# Altium schematic sheet FOC_Driver.SchDoc: FOC_Driver
size 431 x 342 mm; Author: Aiano_czm; SheetNumber: 1; SheetTotal: 1
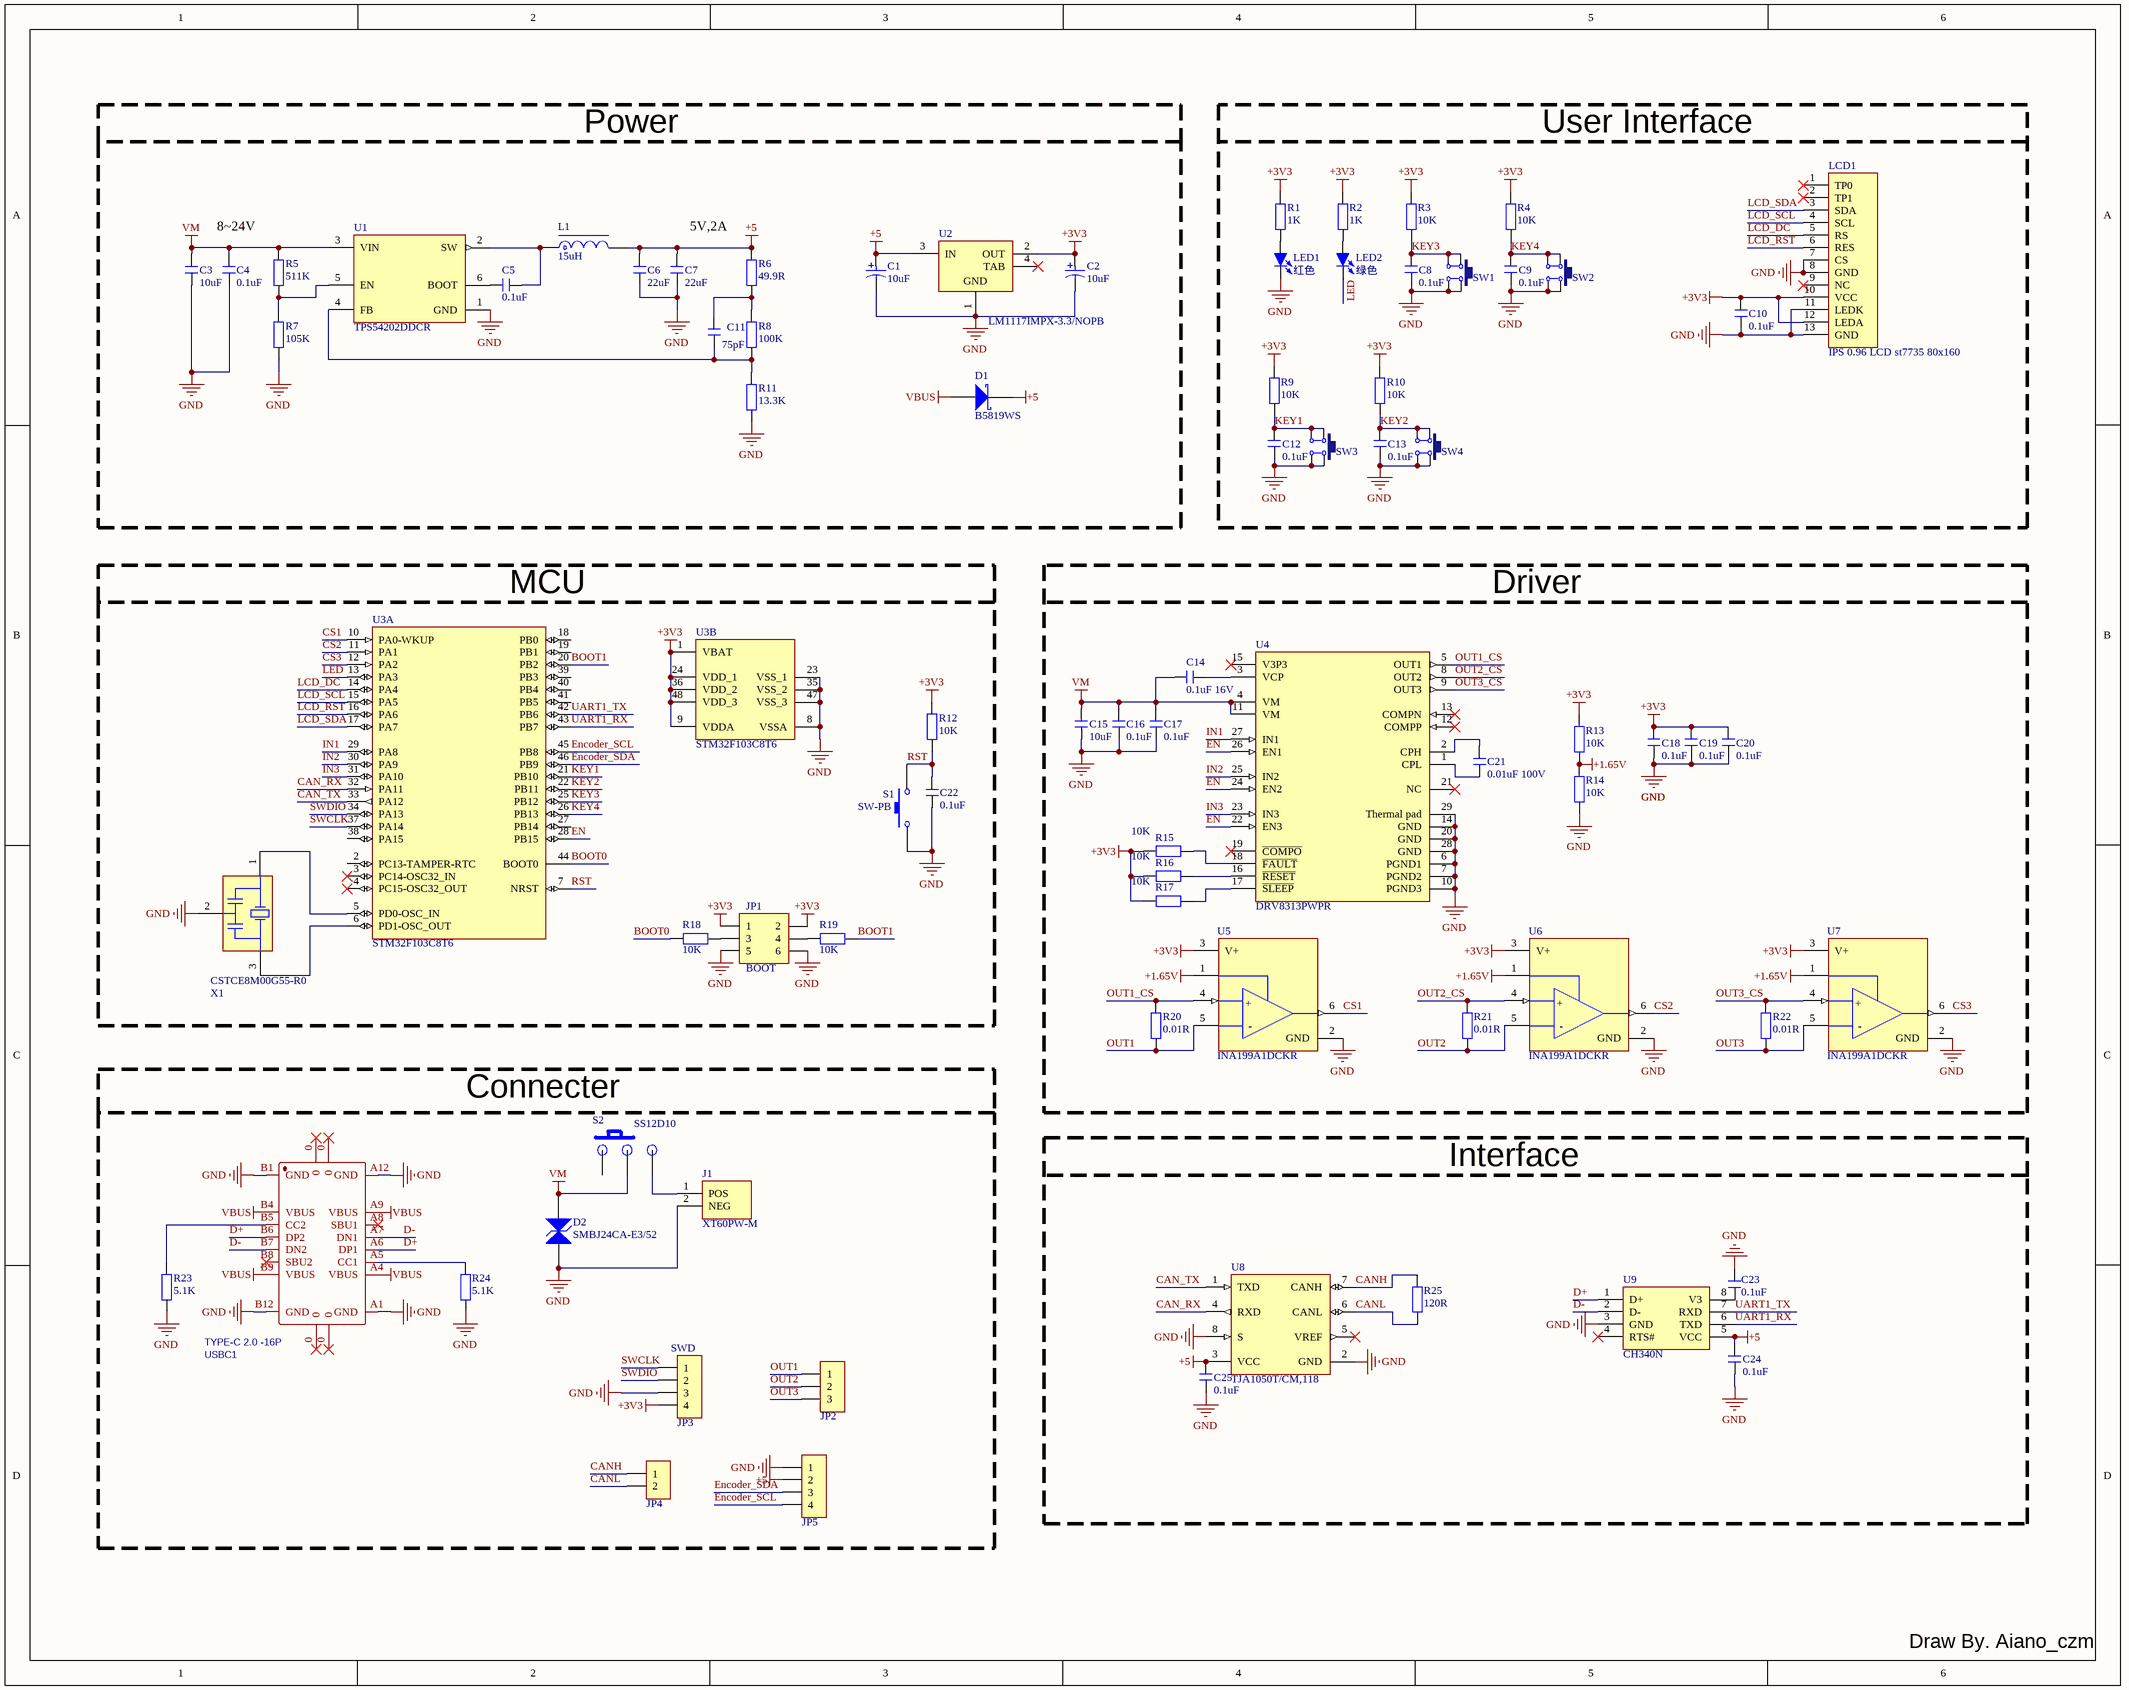
[diagram p0: FOC_Driver.SchDoc]

## Parts
C1  10uF  [CAPMP3217X18-T_V]
C2  10uF  [CAPMP3217X18-T_V]
C3  10uF  [C 1206_M]
C4  0.1uF  [C 0603_M]
C5  0.1uF  [C 0603_M]
C6  22uF  [C 1206_M]
C7  22uF  [C 1206_M]
C8  0.1uF  [C 0603_M]
C9  0.1uF  [C 0603_M]
C10  0.1uF  [C 0603_M]
C11  75pF  [C 0603_M]
C12  0.1uF  [C 0603_M]
C13  0.1uF  [C 0603_M]
C14  0.1uF 16V  [C 0603_M]
C15  10uF  [C 1206_M]
C16  0.1uF  [C 0603_M]
C17  0.1uF  [C 0603_M]
C18  0.1uF  [C 0603_M]
C19  0.1uF  [C 0603_M]
C20  0.1uF  [C 0603_M]
C21  0.01uF 100V  [C 0603_M]
C22  0.1uF  [C 0603_L]
C23  0.1uF  [C 0603_M]
C24  0.1uF  [C 0603_M]
C25  0.1uF  [C 0603_M]
D1  B5819WS  [SOD-323]
D2  SMBJ24CA-E3/52  [VISH-DO-214AA-A-2_V]
J1  XT60PW-M  [AMASS_XT60PW-M]
JP1  BOOT  [HDR2.54-LI-2x3P]
JP2  HDR-1X3  [KF301-5.0-3P]  (value not drawn)
JP3  SWD  [HDR2.54-LI-4P]
JP4  HDR-1X2  [KF301-5.0-2P]  (value not drawn)
JP5  HDR-1X4  [HDR2.54-M-LI-4P]  (value not drawn)
L1  15uH  [CDRH73]
LCD1  IPS 0.96 LCD st7735 80x160  [IPS 0.96 LCD st7735 80x160]
LED1  红色  [LED 0603R]
LED2  绿色  [LED 0603R]
R1  1K  [R 0603_M]
R2  1K  [R 0603_M]
R3  10K  [R 0603_M]
R4  10K  [R 0603_M]
R5  511K  [R 0603_M]
R6  49.9R  [R 0603_M]
R7  105K  [R 0603_M]
R8  100K  [R 0603_M]
R9  10K  [R 0603_M]
R10  10K  [R 0603_M]
R11  13.3K  [R 0603_M]
R12  10K  [R 0603_M]
R13  10K  [R 0603_M]
R14  10K  [R 0603_M]
R15  10K  [R 0603_M]
R16  10K  [R 0603_M]
R17  10K  [R 0603_M]
R18  10K  [R 0603_M]
R19  10K  [R 0603_M]
R20  0.01R  [R 0805_M]
R21  0.01R  [R 0805_M]
R22  0.01R  [R 0805_M]
R23  5.1K  [R 0603_M]
R24  5.1K  [R 0603_M]
R25  120R  [R 0603_M]
S1  SW-PB  [SW_PB2_A1]
S2  SS12D10  [SS12D10]
SW1  6x6x5  [TSW SMD-6*6*4.3]  (value not drawn)
SW2  6x6x5  [TSW SMD-6*6*4.3]  (value not drawn)
SW3  6x6x5  [TSW SMD-6*6*4.3]  (value not drawn)
SW4  6x6x5  [TSW SMD-6*6*4.3]  (value not drawn)
U1  TPS54202DDCR  [FP-DDC0006A-IPC_B]
U2  LM1117IMPX-3.3/NOPB  [MP04A_M]
U3  STM32F103C8T6  [STM-LQFP48_M]  (parts A,B of 2)
U4  DRV8313PWPR  [FP-PWP0028C-IPC_B]
U5  INA199A1DCKR  [FP-DCK0006A-IPC_A]
U6  INA199A1DCKR  [FP-DCK0006A-IPC_A]
U7  INA199A1DCKR  [FP-DCK0006A-IPC_A]
U8  TJA1050T/CM,118  [NXP-SOT96-1_M]
U9  CH340N  [CH340N]
USBC1  TYPE-C 2.0 -16P  [USB-C-SMD_TYPE-C-USB-5]
X1  CSTCE8M00G55-R0  [MURA-CSTCE_G_A-3_V]

## Blocks framed on the sheet
User Interface: C8-C10 C12 C13 LCD1 LED1 LED2 R1-R4 R9 R10 SW1-SW4
MCU: C22 JP1 R12 R18 R19 S1 U3 X1
Driver: C14-C21 R13-R17 R20-R22 U4-U7
Connecter: D2 J1 JP2-JP5 R23 R24 S2 USBC1

## Nets
+1.65V: R13.1 R14.2 U5.1(REF) U6.1(REF) U7.1(REF)
+3V3: C2.1 C10.2 C18.1 C19.1 C20.1 JP1.1 JP1.2 JP3.4 LCD1.10(VCC) LCD1.12(LEDA) R1.1 R2.1 R3.1 R4.1 R9.1 R10.1 R12.2 R13.2 R15.2 R16.2 R17.2 U2.2(OUT) U3.1(VBAT) U3.9(VDDA) U3.24(VDD_1) U3.36(VDD_2) U3.48(VDD_3) U5.3(V+) U6.3(V+) U7.3(V+)
+5: C1.1 C6.2 C7.2 C24.2 C25.1 D1.2(K) JP5.2 L1.2 R6.2 U2.3(IN) U8.3(VCC) U9.5(VCC)
GND: C1.2 C2.2 C3.1 C4.1 C6.1 C7.1 C8.2 C9.2 C10.1 C12.2 C13.2 C15.1 C16.1 C17.1 C18.2 C19.2 C20.2 C22.1 C23.2 C24.1 C25.2 D2.1(A) J1.2(NEG) JP1.5 JP1.6 JP3.3 JP5.1 LCD1.7(CS) LCD1.8(GND) LCD1.11(LEDK) LCD1.13(GND) LED1.2(K) R7.1 R11.1 R14.1 R23.1 R24.1 S1.1 SW1.2 SW1.3 SW2.2 SW2.3 SW3.2 SW3.3 SW4.2 SW4.3 U1.1(GND) U2.1(GND) U3.8(VSSA) U3.23(VSS_1) U3.35(VSS_2) U3.47(VSS_3) U4.6(PGND1) U4.7(PGND2) U4.10(PGND3) U4.14(GND) U4.20(GND) U4.28(GND) U4.29(Thermal_pad) U5.2(GND) U6.2(GND) U7.2(GND) U8.2(GND) U8.8(S) U9.3(GND) USBC1.A1(GND) USBC1.A12(GND) USBC1.B1(GND) USBC1.B12(GND) X1.2(GND)
VBUS: D1.1(A) USBC1.A4(VBUS) USBC1.A9(VBUS) USBC1.B4(VBUS) USBC1.B9(VBUS)
VM: C3.2 C4.2 C14.2 C15.2 C16.2 C17.2 D2.2(A) R5.2 S2.2 U1.3(VIN) U4.4(VM) U4.11(VM)
BOOT0: R18.2 U3.44(BOOT0)
BOOT1: R19.1 U3.20(PB2)
CAN_RX: U3.32(PA11) U8.4(RXD)
CAN_TX: U3.33(PA12) U8.1(TXD)
CANH: JP4.1 R25.2 U8.7(CANH)
CANL: JP4.2 R25.1 U8.6(CANL)
CS1: U3.10(PA0-WKUP) U5.6(OUT)
CS2: U3.11(PA1) U6.6(OUT)
CS3: U3.12(PA2) U7.6(OUT)
D+: U9.1(D+) USBC1.A6(DP1) USBC1.B6(DP2)
D-: U9.2(D-) USBC1.A7(DN1) USBC1.B7(DN2)
EN: U3.28(PB15) U4.22(EN3) U4.24(EN2) U4.26(EN1)
Encoder_SCL: JP5.4 U3.45(PB8)
Encoder_SDA: JP5.3 U3.46(PB9)
IN1: U3.29(PA8) U4.27(IN1)
IN2: U3.30(PA9) U4.25(IN2)
IN3: U3.31(PA10) U4.23(IN3)
KEY1: C12.1 R9.2 SW3.1 SW3.4 U3.21(PB10)
KEY2: C13.1 R10.2 SW4.1 SW4.4 U3.22(PB11)
KEY3: C8.1 R3.2 SW1.1 SW1.4 U3.25(PB12)
KEY4: C9.1 R4.2 SW2.1 SW2.4 U3.26(PB13)
LCD_DC: LCD1.5(RS) U3.14(PA4)
LCD_RST: LCD1.6(RES) U3.16(PA6)
LCD_SCL: LCD1.4(SCL) U3.15(PA5)
LCD_SDA: LCD1.3(SDA) U3.17(PA7)
LED: LED2.2(K) U3.13(PA3)
OUT1: JP2.1 R20.1 U5.5(IN-)
OUT1_CS: R20.2 U4.5(OUT1) U5.4(IN+)
OUT2: JP2.2 R21.1 U6.5(IN-)
OUT2_CS: R21.2 U4.8(OUT2) U6.4(IN+)
OUT3: JP2.3 R22.1 U7.5(IN-)
OUT3_CS: R22.2 U4.9(OUT3) U7.4(IN+)
RST: C22.2 R12.1 S1.2 U3.7(NRST)
SWCLK: JP3.1 U3.37(PA14)
SWDIO: JP3.2 U3.34(PA13)
UART1_RX: U3.43(PB7) U9.6(TXD)
UART1_TX: U3.42(PB6) U9.7(RXD)
NetC5_1: C5.1 U1.6(BOOT)
NetC5_2: C5.2 L1.1 U1.2(SW)
NetC11_1: C11.1 R8.1 R11.2 U1.4(FB)
NetC11_2: C11.2 R6.1 R8.2
NetC14_1: C14.1 U4.3(VCP)
NetC21_1: C21.1 U4.1(CPL)
NetC21_2: C21.2 U4.2(CPH)
NetC23_1: C23.1 U9.8(V3)
NetJ1_1: J1.1(POS) S2.3
NetJP1_3: JP1.3 R18.1
NetJP1_4: JP1.4 R19.2
NetLED1_1: LED1.1(A) R1.2
NetLED2_1: LED2.1(A) R2.2
NetR5_1: R5.1 R7.2 U1.5(EN)
NetR15_1: R15.1 U4.18(~{FAULT})
NetR16_1: R16.1 U4.16(~{RESET})
NetR17_1: R17.1 U4.17(~{SLEEP})
NetR23_2: R23.2 USBC1.B5(CC2)
NetR24_2: R24.2 USBC1.A5(CC1)
NetU3_5: U3.5(PD0-OSC_IN) X1.1(X1)
NetU3_6: U3.6(PD1-OSC_OUT) X1.3(X2)

Not connected (* = marked no-connect by the designer): LCD1 1(TP0)* 2(TP1)* 9(NC)*; S2 1; U2 4(TAB)*; U3 2(PC13-TAMPER-RTC) 3(PC14-OSC32_IN)* 4(PC15-OSC32_OUT)* 18(PB0) 19(PB1) 27(PB14) 38(PA15) 39(PB3) 40(PB4) 41(PB5); U4 12(COMPP)* 13(COMPN)* 15(V3P3)* 19(~{COMPO})* 21(NC)*; U8 5(VREF)*; U9 4(RTS#)*; USBC1 0* A8(SBU1)* B8(SBU2)*

## Notes on the sheet
- Power
- 8~24V
- 5V,2A
- Interface
- Draw By. Aiano_czm
- (in symbol CMP-0704-00049-3) +; -

## Library data of the parts
C1 C2 = CMP-1661-00004-1: Standard Tantalum, 10 uF, +/- 10%, 16 V, -55 to 125 degC, 2-Pin SMD (1206), RoHS, Tape and Reel; Frequency: 300 MHz; Vce Max: 500 mV; hFE Min: 60; Elements: 2; Case\Package: SOT-26; Max Power Dissipation: 300 mW; Min Operating Temperature: -55 degC; Width: 1.7 mm; ComponentLink2URL: http://datasheets.avx.com/TAJ.pdf; PackageDescription: 2-Pin Surface Mount Device, Body 3.2 x 1.65 mm; RoHSCompliant: true; ComponentLink2Description: Datasheet; Package Quantity: 3000; Max Operating Temperature: 150 degC; Length: 3.1 mm; Mount: Surface Mount; Packaging: Tape and Reel; ComponentLink1URL: http://www.avx.com/; ComponentLink1Description: Manufacturer URL; DatasheetVersion: Feb-16; ComponentLink3URL: http://www.avx.com/download/software/literature/AVX-Footprint-Library.pdf; ComponentLink3Description: Package Specification; Height: 1.3 mm; PackageReference: CAPMP3217X18-T; REACH SVHC: No SVHC; Pins: 6; Radiation Hardening: No
C3-C25 = C: 贴片电容; BOM名称: 无极性贴片电容; 淘宝ID: 封装库来自淘宝 ID：黄晶宝石; 联系售后，技术支持: https://shop463601444.taobao.com; 唯一出售店铺网址: https://shop463601444.taobao.com
D1 = 1N5819: 肖特基二极管; 淘宝ID: 封装库来自淘宝 ID：黄晶宝石; 属性: 40V/2A; BOM名称: 肖特基二极管; 欢迎光临: https://shop463601444.taobao.com
D2 = CMP-2000-07094-1: TRANSZORB(R) Transient Voltage Suppressor, 24 V, -55 to 150 degC, 2-Pin DO-214AA (SMBJ), RoHS, Tape and Reel; Manufacturer: Vishay; Clamping Voltage Vc Max: 38.9V; Peak Pulse Current Ippm: 14A; Product Range: TRANSZORBSMBJSeries; Power Dissipation Pd: 600W; Breakdown Voltage Min: 26.7V; No. of Pins: 2Pins; SVHC: ToBeAdvised; Breakdown Voltage Max: 29.5V; TVS Polarity: Bidirectional; Reverse Stand-Off Voltage Vrwm: 24V; Mounting Technology: SurfaceMount; Package Reference: DO-214AA; Package Description: 2-Pin Surface Mount Device, Body 4.315 x 3.62 mm; Diode Case Style: DO-214AA; Packaging: CutTape; Datasheet URL: http://www.vishay.com/docs/88392/smbj50a.pdf; Peak Pulse Power Dissipation: 600W; Manufacturer URL: http://www.vishay.com/; Datasheet Version: 02/2014
J1 = XT60PW-M: Socket, DC supply, male, PIN: 2; MF: AMASS; Package: Package; SnapEDA_Link: https://www.snapeda.com/parts/XT60PW-M/AMASS/view-part/?ref=snap; MP: XT60PW-M; Value: *; Availability: Not in stock; Price: None; Check_prices: https://www.snapeda.com/parts/XT60PW-M/AMASS/view-part/?ref=eda
JP1 = Header 3X2: 3*2P接插件; 版权归属: 封装库来自淘宝 ID：黄晶宝石; BOM名称: 3*2P接插件; 学习资源: https://shop463601444.taobao.com
JP2 = Header 3: 3P接插件; 版权归属: 封装库来自淘宝 ID：黄晶宝石; BOM名称: 3P接插件; 学习资源: https://shop463601444.taobao.com
JP3 JP5 = Header 4: 4P接插件; 版权归属: 封装库来自淘宝 ID：黄晶宝石; BOM名称: 4P接插件; 学习资源: https://shop463601444.taobao.com
JP4 = Header 2: 2P接插件; 版权归属: 封装库来自淘宝 ID：黄晶宝石; BOM名称: 2P接插件; 技术支持，联系售后: https://shop463601444.taobao.com
L1 = L-CDRH: 功率屏蔽电感; 版权归属: 封装库来自淘宝 ID：黄晶宝石; BOM名称: 功率屏蔽电感; 联系售后: https://shop463601444.taobao.com
LCD1 = IPS 0.96 LCD st7735 80x160: 中景园全彩IPS SPI接口 160x80 LCD显示屏
LED1 LED2 = LED-SMD: 贴片LED; 版权归属: 封装库来自淘宝 ID：黄晶宝石; BOM名称: 贴片LED; 学习资源: https://shop463601444.taobao.com
R1-R25 = R: 贴片电阻; 版权归属: 来自淘宝 ID：黄晶宝石; 封装库来自淘宝卖家 ID：黄晶宝石: 其他店铺购入均为盗版，不享受售后技术支持服务，请立即申请退款; BOM名称: 贴片电阻; 联系售后: https://shop463601444.taobao.com
S1 = SW-PB: 微动开关; Published: 24-Mar-1999; LatestRevisionDate: 17-Jul-2002; LatestRevisionNote: Re-released for DXP Platform.; PackageReference: SPST-2; Publisher: Altium Limited
S2 = SS12D10: 大电流拨动开关 直脚
SW1-SW4 = TSW SMD-6x6: 贴片6x6轻触开关; 版权归属: 封装库来自淘宝 ID：黄晶宝石; BOM名称: 贴片6x6轻触开关; 唯一出售店铺网址: https://shop463601444.taobao.com
U1 = CMP-04918-000439-1: IC REG BUCK ADJ 2A TSOT23-6; Quiescent Current: 40uA; Max Input Voltage: 28V; Min Input Voltage: 4.5V; Switching Frequency: 500kHz; Synchronous Rectifier: Yes; Min Output Voltage: 596mV; Output Type: Adjustable; Number of Outputs: 1; Output Configuration: Positive; Max Operating Temperature: 125°C; Lead Free: Lead Free; Min Operating Temperature: -40°C; RoHS Compliant: Yes; Case/Package: SOT-23-6; Max Output Voltage: 28V; Output Current: 2A; Packaging: Tape and Reel; Mount: Surface Mount
U2 = CMP-0062-01632-3: 800mA Low-Dropout Linear Regulator, 4-pin SOT-223, Pb-Free; Manufacturer: National Semiconductor; CompType: LDO IC; PackageTopMarking: XYTT*N05B; High-Reliability: Y; PowerWise: N; ComponentLink3Description: LM1117 Web Page; Code_JEDEC: TO-261-AA; RoHS: Y; PackageReference: MP04A; ComponentLink3URL: http://www.national.com/pf/LM/LM1117.html; RevisionNote: SCH symbol layout adjusted; ComponentLink2URL: http://www.national.com/ds/LM/LM1117.pdf; ComponentLink2Description: LM1117 Datasheet; ComponentLink1Description: Manufacturer URL; ComponentLink4Description: MP04A Package Page; ComponentLink4URL: http://www.national.com/packaging/folders/mp04a.html; PackageVersion: revB, Apr-2003; DatasheetVersion: Apr-2006; PackageDescription: Molded SOT-223, 6.50 x 3.56 x 1.6mm Body, 4 Lead, 2.3mm Pitch; Code_IPC: SOT223-4; ComponentLink1URL: http://www.national.com/; PinCount: 4; PartNumber: LM1117IMPX-3.3/NOPB
U3 = CMP-0237-00215-3: ARM Cortex-M3 32-bit MCU, 64 KB Flash, 20 KB Internal RAM, 37 I/Os, 48-pin LQFP, -40 to 85 degC, Tray; Supply Voltage(Vcc) min (V): 2; Internal RAM Size (kB): 20; FLASH Size (Prog) (kB): 64; A/D Converter: 2x12-bit (10 Channel); I/Os (High Current): 37; Operating Frequency(F) (Processor speed) (MHz): 72; Core: ARM Cortex-M3; ComponentLink3Description: Package Specification; Mounting Technology: Surface Mount; PartNumber: STM32F103C8T6; PackageReference: LQFP48; Packing: Tray; ComponentLink3URL: http://www.st.com/st-web-ui/static/active/en/resource/technical/document/datasheet/DM00058181.pdf; DatasheetVersion: Rev. 16; ComponentLink1URL: http://www.st.com/web/en/home.html; PackageVersion: Rev. 6, 06/2013; ComponentLink2URL: http://www.st.com/st-web-ui/static/active/en/resource/technical/document/datasheet/CD00161566.pdf; ComponentLink1Description: Manufacturer URL; ComponentLink2Description: Datasheet; PackageDescription: 48-Pin Low Profile Quad Flat Package, 7 x 7 mm Body, 0.5 mm Pitch
U4 = CMP-04915-000025-1: IC MOTOR DRIVER 8V-60V 28HTSSOP; Min Supply Voltage: 8V; Max Supply Voltage: 60V; Number of Outputs: 1; Output Current: 1.75A; Interface: Parallel; Logic Function: AND GATE; Min Operating Temperature: -40°C; Max Operating Temperature: 125°C; Mount: Surface Mount; Lead Free: Lead Free; Package Quantity: 2000; Number of Pins: 28; Case/Package: HTSSOP; Series: -; Packaging: Tape and Reel
U5-U7 = CMP-0704-00049-3: IC OPAMP CURR SENSE 14KHZ SC70-6
U8 = CMP-2000-04923-1: High speed CAN transceiver, 4.75 to 5.25 V, -40 to 150 degC, 8-Pin SO (SOT96-1), RoHS, Tape and Reel; Manufacturer: NXP Semiconductors; Duplex: Half; Number of Drivers/Receivers: 1/1; Product Training Modules: CANandLINBusTransceiver; Receiver Hysteresis: 70mV; Voltage - Supply: 4.75V~5.25V; Dynamic Catalog: CANTransceivers; Other Names: 568-10292-1; PCN Packaging: LighterPackingReels30/Mar/2014; PCN Obsolescence: TJA105028/Apr/2013 / MultipleDevices19/Apr/2013; Standard Package: 1; Family: Interface-Drivers,Receivers,Transceivers; Package Reference: SOT96-1; Mounting Type: SurfaceMount; Package / Case: 8-SOIC(0.154",3.90mmWidth); Package Description: 8-Pin Small Outline Integrated Circuit, Body 4.9 x 3.9 mm, Pitch 1.27 mm; Protocol: CAN; Package/Case: 8-SOIC(0.154",3.90mmWidth); Supplier Device Package: 8-SO; <PCN>: http://media.digikey.com/pdf/PCNs/NXP/201209019F04_TJA1050_Obs.pdf; Minimum Quantity: Transceiver; Datasheet URL: http://www.nxp.com/documents/data_sheet/TJA1050.pdf; Category: IntegratedCircuits(ICs); Quantity Available: CutTape(CT)AlternatePackaging; Datasheet Version: Rev. 4, 10/2003; Type: Transceiver; Packaging: CutTape(CT); Manufacturer URL: http://www.nxp.com/
USBC1 = USB2.0 Type-C 16Pin母座: USB2.0 Type-C 母座 16Pin; BOM_Manufacturer: LCSC; BOM_Supplier: LCSC; BOM_Manufacturer Part: -; spicePre: U; spiceSymbolName: TYPE-C 3.1 -16P_C168689
X1 = CMP-2100-03620-1: Ceramic Resonator, 8 MHz, +/- 0.5%, -20 to 80 degC, 3-Pin SMD, RoHS, Tape and Reel; Manufacturer: Murata; Capacitance: 33pF; Frequency Stability: 0.2%; Self Resonant Frequency: 8MHz; Datasheet Version: 42339.0; RoHSCompliant: True; Datasheet URL: http://www.murata.com/~/media/webrenewal/support/library/catalog/products/timingdevice/ceralock/p16e.ashx; Case/Package: Ceramic; Load Capacitance: 33pF; Tolerance: 0.5%; Mount: SurfaceMount; Height: 0.031inch; Number of Pins: 3; Package Description: 3-Pin Surface Mount Device, Body 3.2 x 1.3 mm, Pitch 1.2 mm; Package Quantity: 1; Lead Free: LeadFree; Contact Plating: Gold; REACH SVHC: NoSVHC; Length: 0.126inch; Width: 0.051inch; Manufacturer URL: http://www.murata.com/; Packaging: TapeandReel; Termination: SMD/SMT; Frequency Tolerance: 0.5%; Max Operating Temperature: 80degC; Composition: Ceramic; Package Reference: CSTCE_G_A-3; Min Operating Temperature: -20degC; Frequency: 8MHz